# Altium schematic sheet UD3B.SchDoc
size C; PageSetup: Record=PageOptions|CenterHorizontal=True|CenterVertical=True|PrintScale=0.54|XCorrection=1.00|YCorrection=1.00|PrintKind=0|BorderSize=5000000|LeftOffset=0|BottomOffset=0|Orientation=2|PaperLength=1000|PaperWidth=1000|Scale=100|PaperSource=7|PrintQuality=-4|MediaType=1|DitherType=10|PaperKind=Letter|PrintScaleMode=1
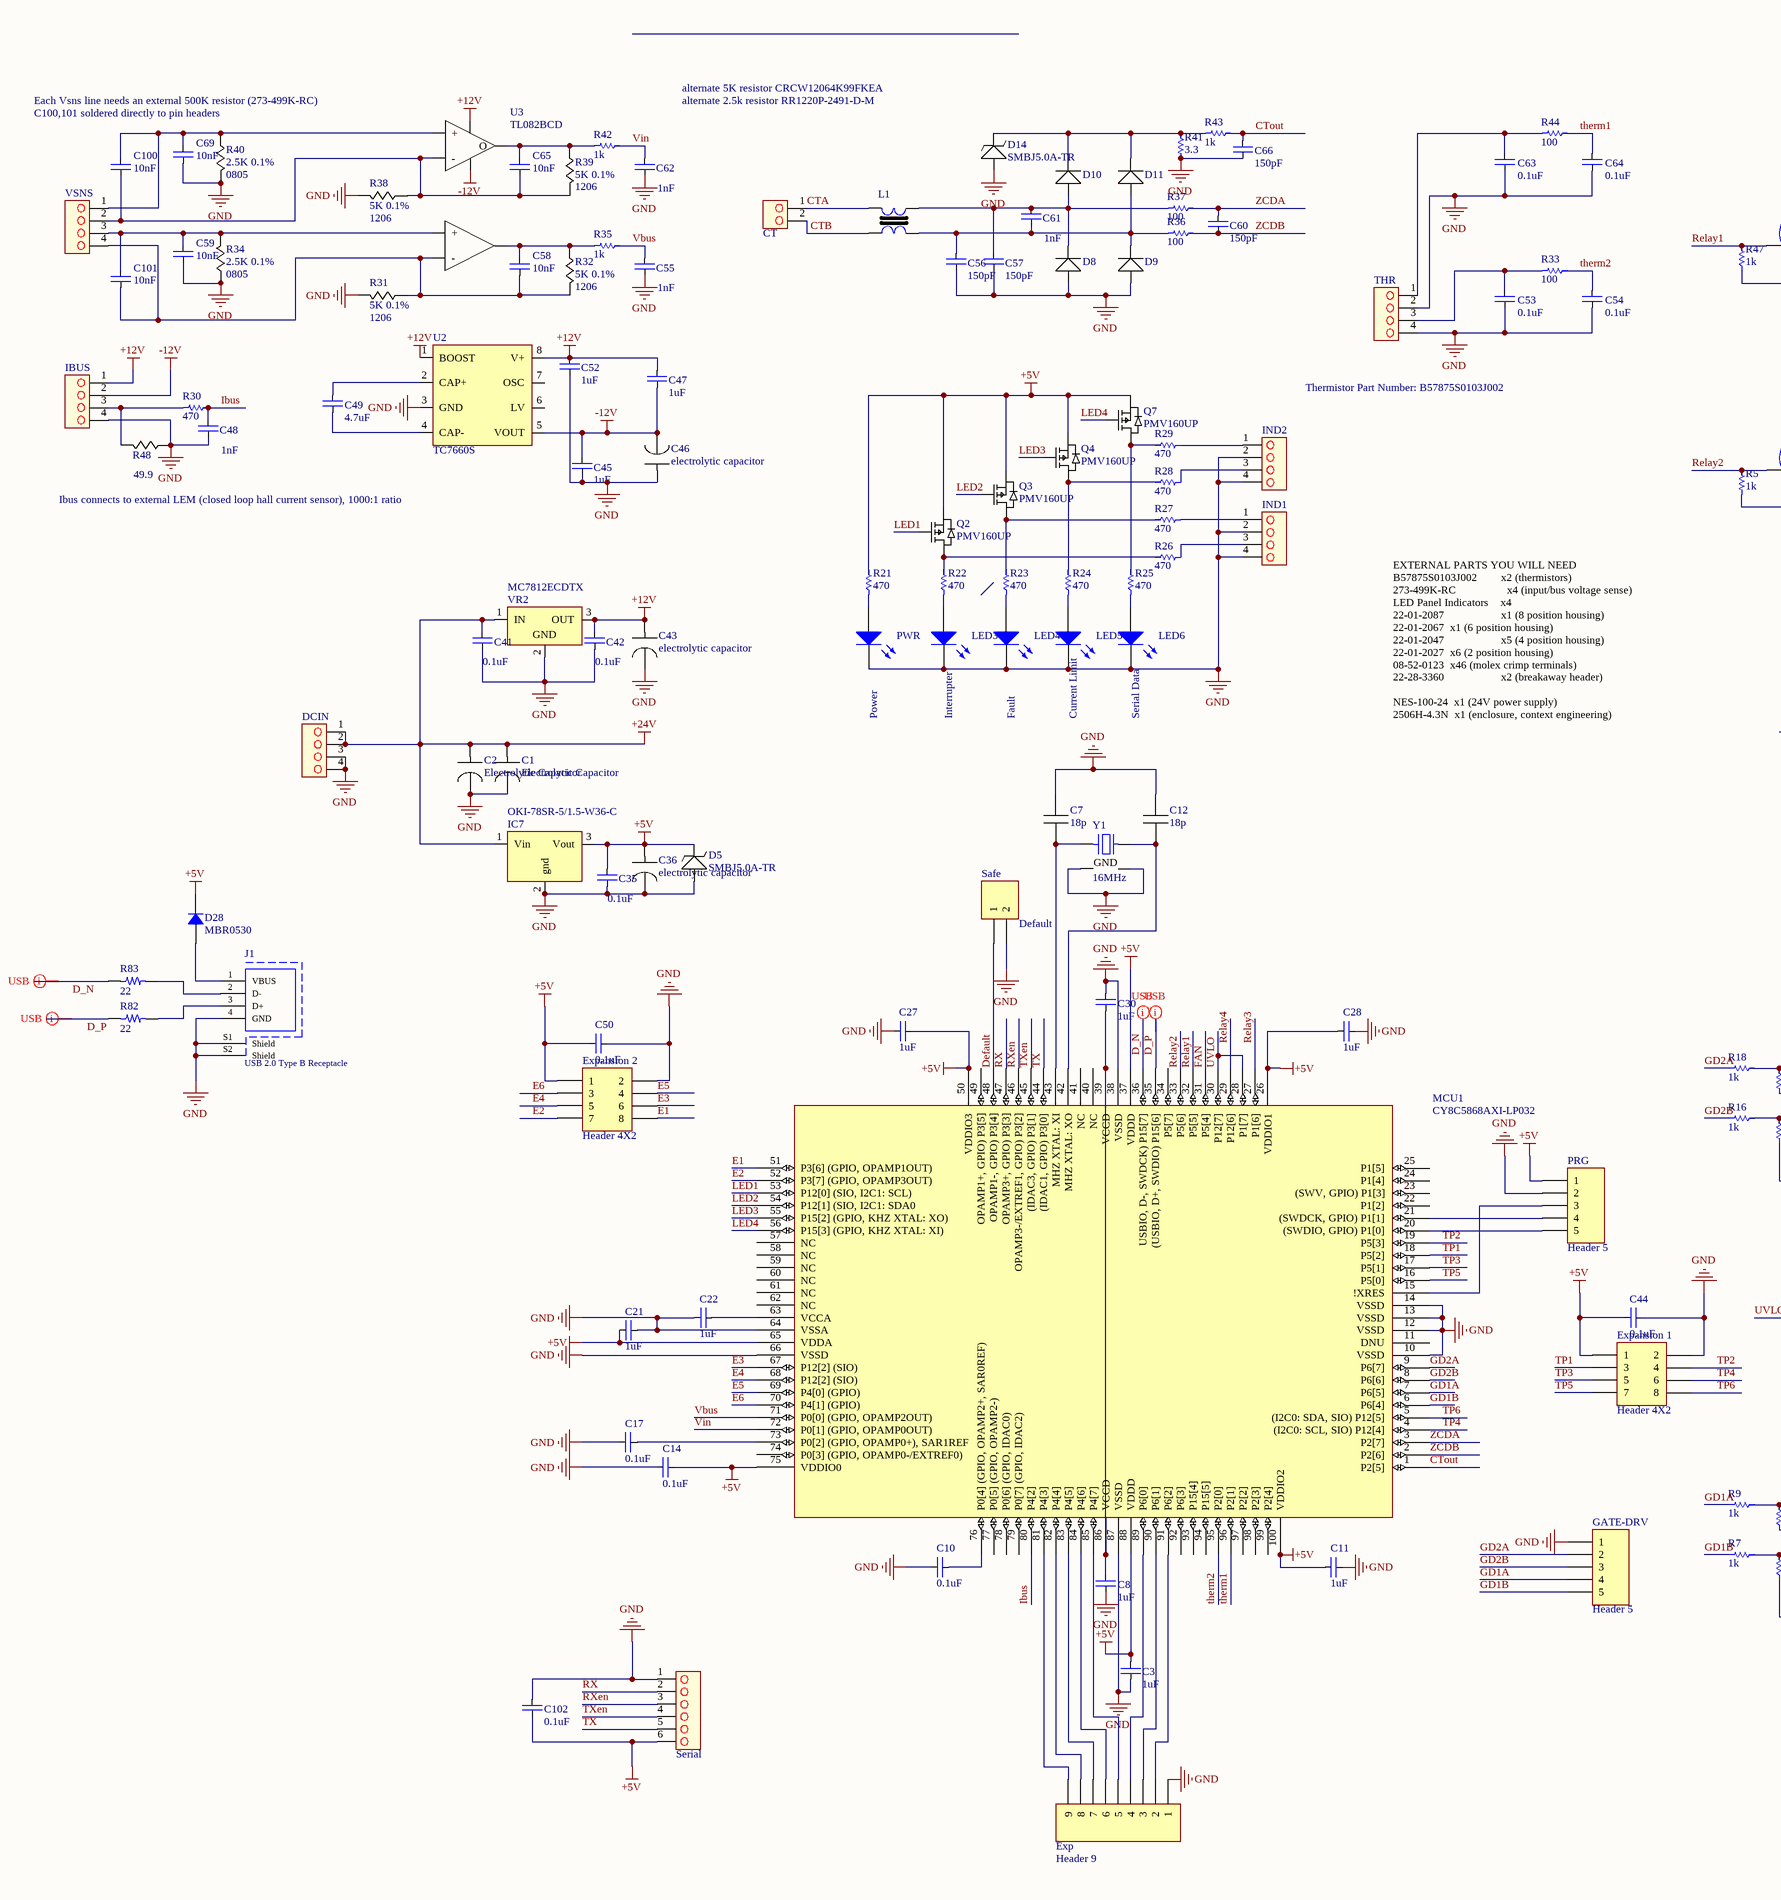
[diagram p0: UD3B.SchDoc, left]
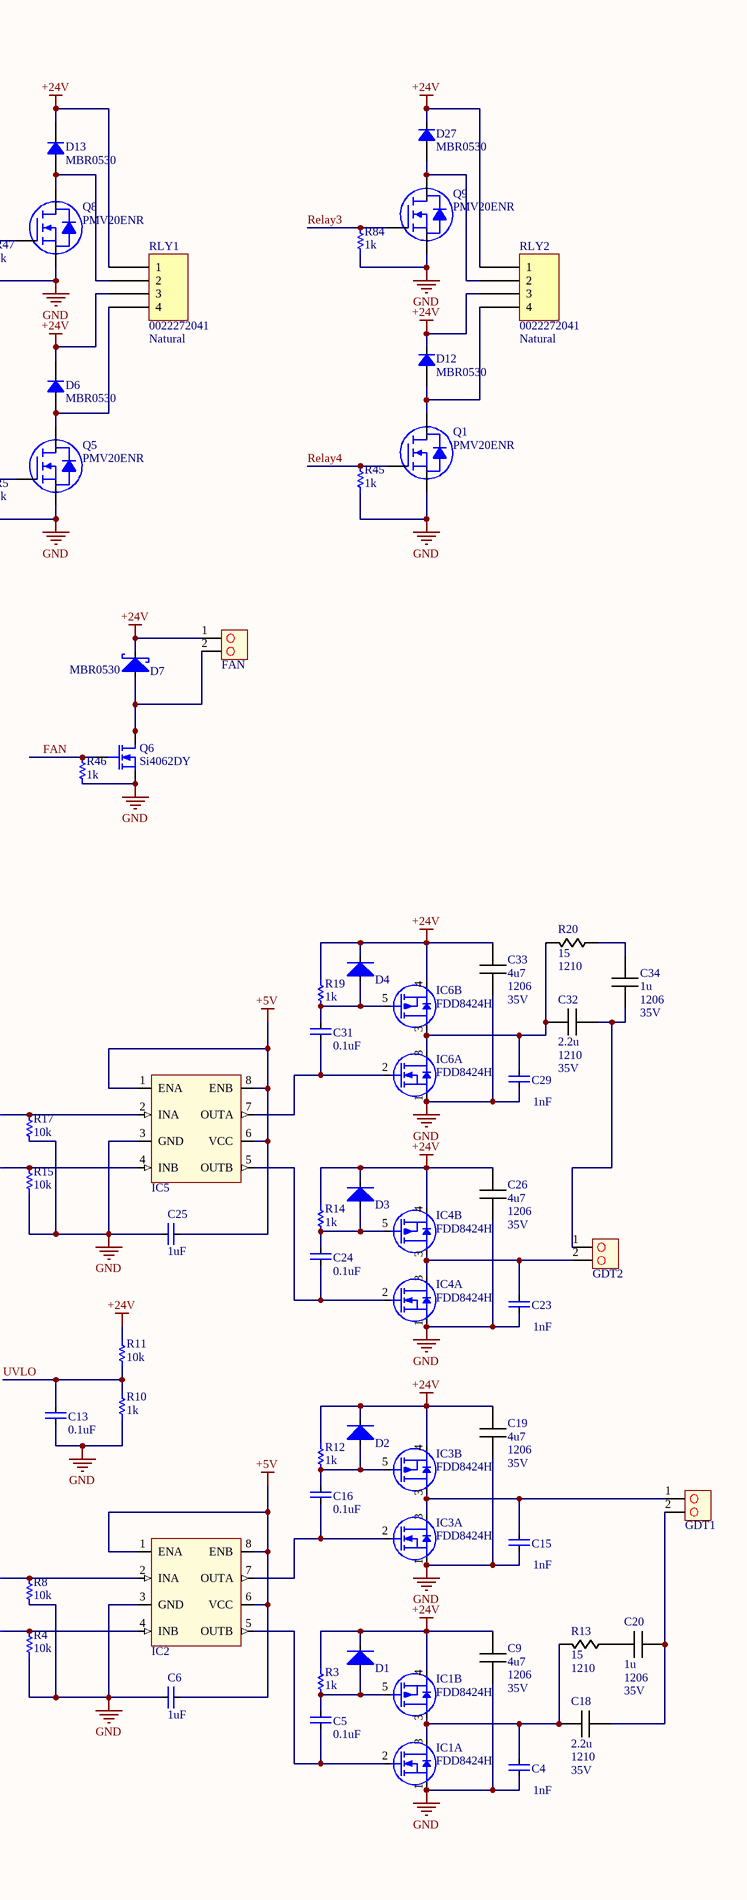
[diagram p1: UD3B.SchDoc, right]

## Parts
C1  Electrolytic Capacitor  [12.5mm lytic]
C2  Electrolytic Capacitor  [12.5mm lytic]
C3  value 1uF  [0805C]  (hidden comment: C0805C105K4RACTU)
C4  value 1nF  [0805C]  (hidden comment: C0805C102K5RACTU)
C5  value 0.1uF  [0805C]  (hidden comment: C0805C104K5RACTU)
C6  value 1uF  [0805C]  (hidden comment: C0805C105K4RACTU)
C7  Capacitance: 18p  [0805C]  (hidden comment: VJ0805A180GXACW1BC)
C8  value 1uF  [0805C]  (hidden comment: C0805C105K4RACTU)
C9  Capacitance: 4u7  package: 1206  voltage: 35V  [1206C]  (hidden comment: GRM31CF51H475ZA01K)
C10  value 0.1uF  [0805C]  (hidden comment: C0805C104K5RACTU)
C11  value 1uF  [0805C]  (hidden comment: C0805C105K4RACTU)
C12  Capacitance: 18p  [0805C]  (hidden comment: VJ0805A180GXACW1BC)
C13  value 0.1uF  [0805C]  (hidden comment: C0805C104K5RACTU)
C14  value 0.1uF  [0805C]  (hidden comment: C0805C104K5RACTU)
C15  value 1nF  [0805C]  (hidden comment: C0805C102K5RACTU)
C16  value 0.1uF  [0805C]  (hidden comment: C0805C104K5RACTU)
C17  value 0.1uF  [0805C]  (hidden comment: C0805C104K5RACTU)
C18  Capacitance: 2.2u  package: 1210  voltage: 35V  [1210C]  (hidden comment: C3225X7R1H225K)
C19  Capacitance: 4u7  package: 1206  voltage: 35V  [1206C]  (hidden comment: GRM31CF51H475ZA01K)
C20  Capacitance: 1u  package: 1206  voltage: 35V  [1206C]  (hidden comment: CC1206ZRY5V9BB105)
C21  value 1uF  [0805C]  (hidden comment: C0805C105K4RACTU)
C22  value 1uF  [0805C]  (hidden comment: C0805C105K4RACTU)
C23  value 1nF  [0805C]  (hidden comment: C0805C102K5RACTU)
C24  value 0.1uF  [0805C]  (hidden comment: C0805C104K5RACTU)
C25  value 1uF  [0805C]  (hidden comment: C0805C105K4RACTU)
C26  Capacitance: 4u7  package: 1206  voltage: 35V  [1206C]  (hidden comment: GRM31CF51H475ZA01K)
C27  value 1uF  [0805C]  (hidden comment: C0805C105K4RACTU)
C28  value 1uF  [0805C]  (hidden comment: C0805C105K4RACTU)
C29  value 1nF  [0805C]  (hidden comment: C0805C102K5RACTU)
C30  value 1uF  [0805C]  (hidden comment: C0805C105K4RACTU)
C31  value 0.1uF  [0805C]  (hidden comment: C0805C104K5RACTU)
C32  Capacitance: 2.2u  package: 1210  voltage: 35V  [1210C]  (hidden comment: C3225X7R1H225K)
C33  Capacitance: 4u7  package: 1206  voltage: 35V  [1206C]  (hidden comment: GRM31CF51H475ZA01K)
C34  Capacitance: 1u  package: 1206  voltage: 35V  [1206C]  (hidden comment: CC1206ZRY5V9BB105)
C35  value 0.1uF  [0805C]  (hidden comment: C0805C104K5RACTU)
C36  electrolytic capacitor  [6.3MM LYTIC]
C41  value 0.1uF  [0805C]  (hidden comment: C0805C104K5RACTU)
C42  value 0.1uF  [0805C]  (hidden comment: C0805C104K5RACTU)
C43  electrolytic capacitor  [6.3MM LYTIC]
C44  value 0.1uF  [0805C]  (hidden comment: C0805C104K5RACTU)
C45  value 1uF  [0805C]  (hidden comment: C0805C105K4RACTU)
C46  electrolytic capacitor  [6.3MM LYTIC]
C47  value 1uF  [0805C]  (hidden comment: C0805C105K4RACTU)
C48  value 1nF  [0805C]  (hidden comment: C0805C102K5RACTU)
C49  value 4.7uF  [1206C]  (hidden comment: GRM31CF51H475ZA01L)
C50  value 0.1uF  [0805C]  (hidden comment: C0805C104K5RACTU)
C52  value 1uF  [0805C]  (hidden comment: C0805C105K4RACTU)
C53  value 0.1uF  [0805C]  (hidden comment: C0805C105K4RACTU)
C54  value 0.1uF  [0805C]  (hidden comment: C0805C105K4RACTU)
C55  value 1nF  [0805C]  (hidden comment: C0805C102K5RACTU)
C56  value 150pF  [0805C]  (hidden comment: C0805C151J5GACTU)
C57  value 150pF  [0805C]  (hidden comment: C0805C151J5GACTU)
C58  value 10nF  [0805C]  (hidden comment: C0805C103K1RACTU)
C59  value 10nF  [0805C]  (hidden comment: C0805C103K1RACTU)
C60  value 150pF  [0805C]  (hidden comment: C0805C151J5GACTU)
C61  value 1nF  [0805C]  (hidden comment: C0805C102K5RACTU)
C62  value 1nF  [0805C]  (hidden comment: C0805C102K5RACTU)
C63  value 0.1uF  [0805C]  (hidden comment: C0805C105K4RACTU)
C64  value 0.1uF  [0805C]  (hidden comment: C0805C105K4RACTU)
C65  value 10nF  [0805C]  (hidden comment: C0805C103K1RACTU)
C66  value 150pF  [0805C]  (hidden comment: C0805C151J5GACTU)
C69  value 10nF  [0805C]  (hidden comment: C0805C103K1RACTU)
C100  value 10nF  [0805C]  (hidden comment: C0805C103K1RACTU)
C101  value 10nF  [0805C]  (hidden comment: C0805C103K1RACTU)
C102  value 0.1uF  [0805C]  (hidden comment: C0805C104K5RACTU)
CT  22-28-0020  [22-28-0020]  (value not drawn)
D1  MCL4148-TR  [MicroMELF]  (value not drawn)
D2  MCL4148-TR  [MicroMELF]  (value not drawn)
D3  MCL4148-TR  [MicroMELF]  (value not drawn)
D4  MCL4148-TR  [MicroMELF]  (value not drawn)
D5  SMBJ5.0A-TR  [SMB]
D6  MBR0530  [SOD123F]
D7  MBR0530  [SOD-123 Diode]
D8  ES2A  [DIOM4326X23N]  (value not drawn)
D9  ES2A  [DIOM4326X23N]  (value not drawn)
D10  ES2A  [DIOM4326X23N]  (value not drawn)
D11  ES2A  [DIOM4326X23N]  (value not drawn)
D12  MBR0530  [SOD123F]
D13  MBR0530  [SOD123F]
D14  SMBJ5.0A-TR  [SMB]
D27  MBR0530  [SOD123F]
D28  MBR0530  [SOD123F]
DCIN  22-28-0040  [22-28-0040]  (value not drawn)
Exp  Header 9  [HDR1X9]
Expansion_1  Header 4X2  [HDR2X4]
Expansion_2  Header 4X2  [HDR2X4]
FAN  22-28-0020  [22-28-0020]  (value not drawn)
GATE-DRV  Header 5  [HDR1X5]
GDT1  22-28-0020  [22-28-0020]  (value not drawn)
GDT2  22-28-0020  [22-28-0020]  (value not drawn)
IBUS  22-28-0040  [22-28-0040]  (value not drawn)
IC1  FDD8424H  [TO-252]  (parts A,B of 2)
IC2  UCC27423D  [SOIC-8]  (value not drawn)
IC3  FDD8424H  [TO-252]  (parts A,B of 2)
IC4  FDD8424H  [TO-252]  (parts A,B of 2)
IC5  UCC27423D  [SOIC-8]  (value not drawn)
IC6  FDD8424H  [TO-252]  (parts A,B of 2)
IC7  OKI-78SR-5/1.5-W36-C  [OKI-78SR vertical]
IND1  22-28-0040  [22-28-0040]  (value not drawn)
IND2  22-28-0040  [22-28-0040]  (value not drawn)
J1  USB 2.0 Type B Receptacle  [61400413321]
L1  DLW5BTN501SQ2L  [DLW5BS]  (value not drawn)
LED3  598-8170-107F  [0805LED]  (value not drawn)
LED4  LS R976-NR-1  [0805LED]  (value not drawn)
LED5  598-8170-107F  [0805LED]  (value not drawn)
LED6  LTST-C171TBKT  [0805LED]  (value not drawn)
MCU1  CY8C5868AXI-LP032  [TQFP100]
PRG  Header 5  [HDR1X5]
PWR  LS R976-NR-1  [0805LED]  (value not drawn)
Q1  PMV20ENR  [NXP SOT-23-3 TO-236AB]
Q2  PMV160UP  [SOT95P245X110-3N]
Q3  PMV160UP  [SOT95P245X110-3N]
Q4  PMV160UP  [SOT95P245X110-3N]
Q5  PMV20ENR  [NXP SOT-23-3 TO-236AB]
Q6  Si4062DY  [SO-8]
Q7  PMV160UP  [SOT95P245X110-3N]
Q8  PMV20ENR  [NXP SOT-23-3 TO-236AB]
Q9  PMV20ENR  [NXP SOT-23-3 TO-236AB]
R3  value 1k  [0805R]  (hidden comment: CRCW08051K00FKEA)
R4  value 10k  [0805R]  (hidden comment: CRCW080510K0FKEA)
R5  value 1k  [0805R]  (hidden comment: CRCW08051K00FKEA)
R7  value 1k  [0805R]  (hidden comment: CRCW08051K00FKEA)
R8  value 10k  [0805R]  (hidden comment: CRCW080510K0FKEA)
R9  value 1k  [0805R]  (hidden comment: CRCW08051K00FKEA)
R10  value 1k  [0805R]  (hidden comment: CRCW08051K00FKEA)
R11  value 10k  [0805R]  (hidden comment: CRCW080510K0FKEA)
R12  value 1k  [0805R]  (hidden comment: CRCW08051K00FKEA)
R13  Resistance: 15  Package: 1210  [1210R]  (hidden comment: CRCW121015R0JNEAHP)
R14  value 1k  [0805R]  (hidden comment: CRCW08051K00FKEA)
R15  value 10k  [0805R]  (hidden comment: CRCW080510K0FKEA)
R16  value 1k  [0805R]  (hidden comment: CRCW08051K00FKEA)
R17  value 10k  [0805R]  (hidden comment: CRCW080510K0FKEA)
R18  value 1k  [0805R]  (hidden comment: CRCW08051K00FKEA)
R19  value 1k  [0805R]  (hidden comment: CRCW08051K00FKEA)
R20  Resistance: 15  Package: 1210  [1210R]  (hidden comment: CRCW121015R0JNEAHP)
R21  value 470  [0805R]  (hidden comment: CRCW0805470RFKEA)
R22  value 470  [0805R]  (hidden comment: CRCW0805470RFKEA)
R23  value 470  [0805R]  (hidden comment: CRCW0805470RFKEA)
R24  value 470  [0805R]  (hidden comment: CRCW0805470RFKEA)
R25  value 470  [0805R]  (hidden comment: CRCW0805470RFKEA)
R26  value 470  [0805R]  (hidden comment: CRCW0805470RFKEA)
R27  value 470  [0805R]  (hidden comment: CRCW0805470RFKEA)
R28  value 470  [0805R]  (hidden comment: CRCW0805470RFKEA)
R29  value 470  [0805R]  (hidden comment: CRCW0805470RFKEA)
R30  value 470  [0805R]  (hidden comment: CRCW0805470RFKEA)
R31  Resistance: 5K 0.1%  Package: 1206  [1206R]  (hidden comment: RN732BTTD5001B25)
R32  Resistance: 5K 0.1%  Package: 1206  [1206R]  (hidden comment: RN732BTTD5001B25)
R33  value 100  [0805R]  (hidden comment: CRCW0805100RFKEA)
R34  Resistance: 2.5K 0.1%  Package: 0805  [0805R]  (hidden comment: RN732ATTD2501B25)
R35  value 1k  [0805R]  (hidden comment: CRCW08051K00FKEA)
R36  value 100  [0805R]  (hidden comment: CRCW0805100RFKEA)
R37  value 100  [0805R]  (hidden comment: CRCW0805100RFKEA)
R38  Resistance: 5K 0.1%  Package: 1206  [1206R]  (hidden comment: RN732BTTD5001B25)
R39  Resistance: 5K 0.1%  Package: 1206  [1206R]  (hidden comment: RN732BTTD5001B25)
R40  Resistance: 2.5K 0.1%  Package: 0805  [0805R]  (hidden comment: RN732ATTD2501B25)
R41  value 3.3  [MOS2CT52R510J]  (hidden comment: 261-3.3-RC)
R42  value 1k  [0805R]  (hidden comment: CRCW08051K00FKEA)
R43  value 1k  [0805R]  (hidden comment: CRCW08051K00FKEA)
R44  value 100  [0805R]  (hidden comment: CRCW0805100RFKEA)
R45  value 1k  [0805R]  (hidden comment: CRCW08051K00FKEA)
R46  value 1k  [0805R]  (hidden comment: CRCW08051K00FKEA)
R47  value 1k  [0805R]  (hidden comment: CRCW08051K00FKEA)
R48  Resistance: 49.9  [1210R]  (hidden comment: CRCW121049R9FKEA)
R82  22  [RES 0603/1608]
R83  22  [RES 0603/1608]
R84  value 1k  [0805R]  (hidden comment: CRCW08051K00FKEA)
RLY1  0022272041  Colour: Natural  [MOLEX KK 0022272041]
RLY2  0022272041  Colour: Natural  [MOLEX KK 0022272041]
Safe  Default  [HDR1X2]
Serial  22-28-0060  [22-28-0060]  (value not drawn)
THR  22-28-0040  [22-28-0040]  (value not drawn)
U2  TC7660S  [SO-8]
U3  TL082BCD  [SO-8]
VR2  MC7812ECDTX  [DPAK alt]
VSNS  22-28-0040  [22-28-0040]  (value not drawn)
Y1  16MHz  [ABRACON ABM8G]

## Nets
+5V: C3.1 C6.1 C11.1 C14.2 C21.2 C25.1 C27.1 C28.2 C35.2 C36.1 C44.2 C50.2 C102.1 D5.2(K) D28.2 Expansion_1.1 Expansion_2.1 IC2.1(ENA) IC2.6(VCC) IC2.8(ENB) IC5.1(ENA) IC5.6(VCC) IC5.8(ENB) IC7.3(Vout) MCU1.26(VDDIO1) MCU1.37(VDDD) MCU1.50(VDDIO3) MCU1.65(VDDA) MCU1.75(VDDIO0) MCU1.88(VDDD) MCU1.100(VDDIO2) PRG.1 Q2.2(S) Q3.2(S) Q4.2(S) Q7.2(S) R21.2 Serial.6
+12V: C42.2 C43.1 C47.2 C52.2 IBUS.1 U2.1(BOOST) U2.8(V+) U3.8(Vcc) VR2.3(OUT)
+24V: C1.1 C2.1 C9.1 C19.1 C26.1 C33.1 C41.2 D1.K D2.K D3.K D4.K D6.2 D7.K D12.2 D13.2 D27.2 DCIN.1 DCIN.2 FAN.1 IC1.4(S2) IC3.4(S2) IC4.4(S2) IC6.4(S2) IC7.1(Vin) R3.2 R11.2 R12.2 R14.2 R19.2 RLY1.1 RLY1.3 RLY2.1 RLY2.3 VR2.1(IN)
-12V: C45.2 C46.2 C47.1 IBUS.2 U2.5(VOUT) U3.4(Vss)
GND: C1.2 C2.2 C3.2 C4.1 C6.2 C7.1 C8.2 C9.2 C10.1 C11.2 C12.1 C13.1 C14.1 C15.1 C17.1 C19.2 C21.1 C22.2 C23.1 C25.2 C26.2 C27.2 C28.1 C29.1 C30.2 C33.2 C35.1 C36.2 C41.1 C42.1 C43.2 C44.1 C45.1 C46.1 C48.1 C50.1 C52.1 C53.1 C54.1 C55.1 C56.1 C57.1 C59.1 C62.1 C63.1 C64.1 C66.1 C69.1 C102.2 D5.1(A) D8.1(A) D9.1(A) D14.1(A) DCIN.3 DCIN.4 Exp.1 Expansion_1.2 Expansion_2.2 GATE-DRV.1 IBUS.4 IC1.1(S1) IC2.3(GND) IC3.1(S1) IC4.1(S1) IC5.3(GND) IC6.1(S1) IC7.2(gnd) IND1.2 IND1.4 IND2.2 IND2.4 J1.4(GND) J1.S1(Shield) J1.S2(Shield) LED3.2(K) LED4.2(K) LED5.2(K) LED6.2(K) MCU1.10(VSSD) MCU1.12(VSSD) MCU1.13(VSSD) MCU1.14(VSSD) MCU1.38(VSSD) MCU1.64(VSSA) MCU1.66(VSSD) MCU1.87(VSSD) PRG.2 PWR.2(K) Q1.3(S) Q5.3(S) Q6.1(S) Q6.2(S) Q6.3(S) Q8.3(S) Q9.3(S) R4.1 R5.1 R8.1 R10.1 R15.1 R17.1 R31.1 R34.2 R38.1 R40.1 R41.1 R45.1 R46.1 R47.1 R48.2 R84.1 Safe.2 Serial.1 THR.2 THR.4 U2.3(GND) VR2.2(GND) Y1.2(GND) Y1.4(GND)
CTA: CT.1 L1.1
CTB: CT.2 L1.4
CTout: C66.2 MCU1.1(P2[5]) R43.2
D_N: MCU1.36(USBIO,_D-,_SWDCK)_P15[7]) R83.2
D_P: MCU1.35((USBIO,_D+,_SWDIO)_P15[6]) R82.2
Default: MCU1.48(OPAMP1-,_GPIO)_P3[4]) Safe.1
E1: Expansion_2.8 MCU1.51(P3[6]_(GPIO,_OPAMP1OUT))
E2: Expansion_2.7 MCU1.52(P3[7]_(GPIO,_OPAMP3OUT))
E3: Expansion_2.6 MCU1.67(P12[2]_(SIO))
E4: Expansion_2.5 MCU1.68(P12[2]_(SIO))
E5: Expansion_2.4 MCU1.69(P4[0]_(GPIO))
E6: Expansion_2.3 MCU1.70(P4[1]_(GPIO))
FAN: MCU1.31(P5[4]) Q6.4(G) R46.2
GD1A: GATE-DRV.4 MCU1.7(P6[5]) R9.1
GD1B: GATE-DRV.5 MCU1.6(P6[4]) R7.1
GD2A: GATE-DRV.2 MCU1.9(P6[7]) R18.1
GD2B: GATE-DRV.3 MCU1.8(P6[6]) R16.1
Ibus: C48.2 MCU1.80(P4[2]) R30.2
LED1: MCU1.53(P12[0]_(SIO,_I2C1:_SCL)) Q2.1(G)
LED2: MCU1.54(P12[1]_(SIO,_I2C1:_SDA0) Q3.1(G)
LED3: MCU1.55(P15[2]_(GPIO,_KHZ_XTAL:_XO)) Q4.1(G)
LED4: MCU1.56(P15[3]_(GPIO,_KHZ_XTAL:_XI)) Q7.1(G)
Relay1: MCU1.32(P5[5]) Q8.1(G) R47.2
Relay2: MCU1.33(P5[6]) Q5.1(G) R5.2
Relay3: MCU1.27(P1[6]) Q9.1(G) R84.2
Relay4: MCU1.29(P12[6]) Q1.1(G) R45.2
RX: MCU1.47(OPAMP3+,_GPIO)_P3[3]) Serial.2
RXen: MCU1.46(OPAMP3-/EXTREF1,_GPIO)_P3[2]) Serial.3
therm1: C64.2 MCU1.96(P2[1]) R44.2
therm2: C54.2 MCU1.95(P2[0]) R33.2
TP1: Expansion_1.3 MCU1.18(P5[2])
TP2: Expansion_1.4 MCU1.19(P5[3])
TP3: Expansion_1.5 MCU1.17(P5[1])
TP4: Expansion_1.6 MCU1.4((I2C0:_SCL,_SIO)_P12[4])
TP5: Expansion_1.7 MCU1.16(P5[0])
TP6: Expansion_1.8 MCU1.5((I2C0:_SDA,_SIO)_P12[5])
TX: MCU1.44((IDAC1,_GPIO)_P3[0]) Serial.5
TXen: MCU1.45((IDAC3,_GPIO)_P3[1]) Serial.4
UVLO: C13.2 MCU1.28(P1[7]) MCU1.30(P12[7]) R10.2 R11.1
Vbus: C55.2 MCU1.71(P0[0]_(GPIO,_OPAMP2OUT)) R35.2
Vin: C62.2 MCU1.72(P0[1]_(GPIO,_OPAMP0OUT)) R42.2
ZCDA: C60.2 MCU1.3(P2[7]) R37.2
ZCDB: C60.1 MCU1.2(P2[6]) R36.2
NetC4_2: C4.2 C18.1 IC1.3(D1/D2) R13.1
NetC5_1: C5.1 IC1.2(G1) IC2.5(OUTB)
NetC5_2: C5.2 D1.A IC1.5(G2) R3.1
NetC7_2: C7.2 MCU1.43(MHZ_XTAL:_XI) Y1.1
NetC8_1: C8.1 C30.1 MCU1.39(VCCD) MCU1.86(VCCD)
NetC10_2: C10.2 MCU1.76(P0[4]_(GPIO,_OPAMP2+,_SAR0REF))
NetC12_2: C12.2 MCU1.42(MHZ_XTAL:_XO) Y1.3
NetC15_2: C15.2 GDT1.1 IC3.3(D1/D2)
NetC16_1: C16.1 IC2.7(OUTA) IC3.2(G1)
NetC16_2: C16.2 D2.A IC3.5(G2) R12.1
NetC17_2: C17.2 MCU1.73(P0[2]_(GPIO,_OPAMP0+),_SAR1REF)
NetC18_2: C18.2 C20.2 GDT1.2
NetC20_1: C20.1 R13.2
NetC22_1: C22.1 MCU1.63(VCCA)
NetC23_2: C23.2 GDT2.2 IC4.3(D1/D2)
NetC24_1: C24.1 IC4.2(G1) IC5.5(OUTB)
NetC24_2: C24.2 D3.A IC4.5(G2) R14.1
NetC29_2: C29.2 C32.1 IC6.3(D1/D2) R20.1
NetC31_1: C31.1 IC5.7(OUTA) IC6.2(G1)
NetC31_2: C31.2 D4.A IC6.5(G2) R19.1
NetC32_2: C32.2 C34.1 GDT2.1
NetC34_2: C34.2 R20.2
NetC49_1: C49.1 U2.4(CAP-)
NetC49_2: C49.2 U2.2(CAP+)
NetC53_2: C53.2 R33.1 THR.3
NetC56_2: C56.2 C61.1 D9.2(K) D11.1(A) L1.3 R36.1
NetC57_2: C57.2 C61.2 D8.2(K) D10.1(A) L1.2 R37.1
NetC58_1: C58.1 C101.1 R31.2 R32.1 U3.6(-) VSNS.4
NetC58_2: C58.2 R32.2 R35.1 U3.7(O)
NetC59_2: C59.2 C101.2 R34.1 U3.5(+) VSNS.3
NetC63_2: C63.2 R44.1 THR.1
NetC65_1: C65.1 C100.1 R38.2 R39.1 U3.2(-) VSNS.2
NetC65_2: C65.2 R39.2 R42.1 U3.1(O)
NetC69_2: C69.2 C100.2 R40.2 U3.3(+) VSNS.1
NetD6_1: D6.1 Q5.2(D) RLY1.4
NetD7_A: D7.A FAN.2 Q6.5(D) Q6.6(D) Q6.7(D) Q6.8(D)
NetD10_2: D10.2(K) D11.2(K) D14.2(K) R41.2 R43.1
NetD12_1: D12.1 Q1.2(D) RLY2.4
NetD13_1: D13.1 Q8.2(D) RLY1.2
NetD27_1: D27.1 Q9.2(D) RLY2.2
NetD28_1: D28.1 J1.1(VBUS)
NetExp_2: Exp.2 MCU1.91(P6[2])
NetExp_3: Exp.3 MCU1.90(P6[1])
NetExp_4: Exp.4 MCU1.89(P6[0])
NetExp_5: Exp.5 MCU1.85(P4[7])
NetExp_6: Exp.6 MCU1.84(P4[6])
NetExp_7: Exp.7 MCU1.83(P4[5])
NetExp_8: Exp.8 MCU1.82(P4[4])
NetExp_9: Exp.9 MCU1.81(P4[3])
NetIBUS_3: IBUS.3 R30.1 R48.1
NetIC2_2: IC2.2(INA) R8.2 R9.2
NetIC2_4: IC2.4(INB) R4.2 R7.2
NetIC5_2: IC5.2(INA) R17.2 R18.2
NetIC5_4: IC5.4(INB) R15.2 R16.2
NetIND1_1: IND1.1 R27.1
NetIND1_3: IND1.3 R26.1
NetIND2_1: IND2.1 R29.1
NetIND2_3: IND2.3 R28.1
NetJ1_2: J1.2(D-) R83.1
NetJ1_3: J1.3(D+) R82.1
NetLED3_1: LED3.1(A) R22.1
NetLED4_1: LED4.1(A) R23.1
NetLED5_1: LED5.1(A) R24.1
NetLED6_1: LED6.1(A) R25.1
NetMCU1_15: MCU1.15(!XRES) PRG.3
NetMCU1_20: MCU1.20((SWDIO,_GPIO)_P1[0]) PRG.5
NetMCU1_21: MCU1.21((SWDCK,_GPIO)_P1[1]) PRG.4
NetPWR_1: PWR.1(A) R21.1
NetQ2_3: Q2.3(D) R22.2 R26.2
NetQ3_3: Q3.3(D) R23.2 R27.2
NetQ4_3: Q4.3(D) R24.2 R28.2
NetQ7_3: Q7.3(D) R25.2 R29.2

Not connected (* = marked no-connect by the designer): MCU1 11(DNU) 22(P1[2]) 23((SWV,_GPIO)_P1[3]) 24(P1[4]) 25(P1[5]) 34(P5[7]) 40(NC) 41(NC) 49(OPAMP1+,_GPIO)_P3[5]) 57(NC) 58(NC) 59(NC) 60(NC) 61(NC) 62(NC) 74(P0[3]_(GPIO,_OPAMP0-/EXTREF0)) 77(P0[5]_(GPIO,_OPAMP2-)) 78(P0[6]_(GPIO,_IDAC0)) 79(P0[7]_(GPIO,_IDAC2)) 92(P6[3]) 93(P15[4]) 94(P15[5]) 97(P2[2]) 98(P2[3]) 99(P2[4]); U2 6(LV) 7(OSC)

## Layout directives
differential pair: D_N, D_P

## Notes on the sheet
- Each Vsns line needs an external 500K resistor (273-499K-RC)
- C100,101 soldered directly to pin headers
- alternate 5K resistor CRCW12064K99FKEA
- alternate 2.5k resistor RR1220P-2491-D-M
- Thermistor Part Number: B57875S0103J002
- Ibus connects to external LEM (closed loop hall current sensor), 1000:1 ratio
- (near PWR) Power
- (near LED3) Interrupter
- Fault
- (near LED5) Current Limit
- (near LED6) Serial Data
- EXTERNAL PARTS YOU WILL NEED
  B57875S0103J002       	x2 (thermistors)
  273-499K-RC                	x4 (input/bus voltage sense)
  LED Panel Indicators   	x4
  22-01-2087                  	x1 (8 position housing)
  22-01-2067		x1 (6 position housing)
  22-01-2047                  	x5 (4 position housing)
  22-01-2027		x6 (2 position housing)
  08-52-0123		x46 (molex crimp terminals)
  22-28-3360                  	x2 (breakaway header)
  NES-100-24		x1 (24V power supply)
  2506H-4.3N		x1 (enclosure, context engineering)

## Library data of the parts
C3 C6 C8 C11 C21 C22 C25 C27 C28 C30 C45 C47 C52-C54 C63 C64 = C0805C105K4RACTU: Capacitor, 1uF, MLCC, 16V, X7R, 10%, SMD
C4 C15 C23 C29 C48 C55 C61 C62 = C0805C102K5RACTU: Capacitor, 1nF, MLCC, 50V, X7R, 10%, SMD
C5 C10 C13 C14 C16 C17 C24 C31 C35 C41 C42 C44 C50 C102 = C0805C104K5RACTU: Capacitor, 0.1uF, MLCC, 50V, X7R, 10%, SMD
C7 C9 C12 C18-C20 C26 C32-C34 = Capacitor: tolerance: *; type: *; material: *
C49 = GRM31CF51H475ZA01L: Capacitor, 4.7uF, MLCC, 50V, Y5V, +80-20%
C56 C57 C60 C66 = C0805C151J5GACTU: Capacitor, 150pF, MLCC, 50V, COG, 5%, SMD
C58 C59 C65 C69 C100 C101 = C0805C103K1RACTU: Capacitor, 10nF, MLCC, 50V, X7R, 10%, SMD
CT FAN GDT1 GDT2 = 22-28-0020: Pin Header, 2 Position, Locking, .1 Centers
D1-D4 = MCL4148-TR: Diode, 100V, 350mA, Small Switching, SMD
D5 D14 = SMBJ170A
D6 D12 D13 D27 D28 = MBR0530: DIODE SCHOTTKY 30V 500MA SOD123; Manufacturer: Fairchild Semiconductor; Type: Surface Mount; Current Reverse Leakage @ Vr: 130uA @ 30V; Voltage Forward (Vf): 430mV @ 500mA; Part Number: MBR0530; PartId: 7121; Supplier 1: Digi-Key; Supplier Part Number 1: MBR0530TR-ND; ComponentLink1Description: Datasheet; ComponentLink1URL: http://www.fairchildsemi.com/datasheets/MB/MBR0530.pdf; ComponentLink2Description: Digi-Key Listing; ComponentLink2URL: http://www.digikey.ca/product-detail/en/MBR0530/MBR0530TR-ND/1048783; Junction Operating Temperature: -65C ~ 125C; Price: 0,0818; Device Package: SOD-123; Reverse Recovery Time (trr): -; Voltage DC Reverse (Vr): 30V; Current Rectified: 500mA
D7 = MBR0530: Diode, Schottky, 30V, 500mA, SMD
D8-D11 = US1J-13-F
DCIN IBUS IND1 IND2 THR VSNS = 22-28-0040: Pin Header, 4 Position, Locing, .1 Centers
Exp = Header 9: Header, 9-Pin; LatestRevisionDate: 17-Jul-2002; LatestRevisionNote: Re-released for DXP Platform.; Publisher: Altium Limited
Expansion_1 Expansion_2 = Header 4X2: Header, 4-Pin, Dual row; LatestRevisionDate: 17-Jul-2002; LatestRevisionNote: Re-released for DXP Platform.; Publisher: Altium Limited
GATE-DRV PRG = Header 5: Header, 5-Pin; LatestRevisionDate: 17-Jul-2002; LatestRevisionNote: Re-released for DXP Platform.; Publisher: Altium Limited
IC1 IC3 IC4 IC6 = FDD8424H: Mosfet, NP CH, 40V, -40V, 20A
IC2 IC5 = UCC27423D: Mosfet Driver, Dual-Inverting, SOIC-D; Manufacturer: Texas Instruments; Manf. P/N: UCC27322D
IC7 = OKI-78SR
J1 = 61400413321: USB 2.0 Type B, Receptacle, Vertical, THT; Rated Current: 1.5A; Pin Number: 4; Interface Type: Type B; Working Voltage: 30VAC; ComponentLink1Description: Manufacturer; ComponentLink1URL: http://www.we-online.de; ComponentLink2Description: Datasheet; ComponentLink2URL: https://katalog.we-online.com/em/datasheet/61400413321.pdf; Published Date: September 2019; Publisher: Wurth Elektronik; Part Number: 61400413321; Gender: Receptacle; Type: Vertical; Packaging: Tray; Operating Temperature: -40 to +105degC; Mounting Technology: THT; Application: USB 2.0
L1 = common mode choke
LED3 LED5 = HLMP-6700-G0011: GREEN LED; LuminousIntensity: 1.4mcd (Minimum).; LED_Colour: Yellow; PCB_Layout: Complies with manufacturer's recommendation.; Note: SIM model accounts for the Domed Subminiature Resistor. Extra resistance has been added to the parameter RS.; Published: 11-Dec-2002; LatestRevisionDate: 19-Mar-2004; LatestRevisionNote: Silkscreen size reduced.; DatasheetVersion: 30-Apr-2002; PackageVersion: Apr-2001; PackageReference: 2.2X2.1X2.9; Publisher: Altium Limited; PackageDescription: SM LED; 2 Gull Wing Leads; Body 2.2 x 2.1 mm, (LxW); ComponentLink1Description: Manufacturer Link; ComponentLink1URL: http://www.avagotech.com/; ComponentLink2Description: Datasheet; ComponentLink2URL: http://cp.literature.agilent.com/litweb/pdf/5988-6260EN.pdf
LED4 PWR = HLMP-6700-G0011: RED LED; LuminousIntensity: 1.4mcd (Minimum).; LED_Colour: Yellow; PCB_Layout: Complies with manufacturer's recommendation.; Note: SIM model accounts for the Domed Subminiature Resistor. Extra resistance has been added to the parameter RS.; Published: 11-Dec-2002; LatestRevisionDate: 19-Mar-2004; LatestRevisionNote: Silkscreen size reduced.; DatasheetVersion: 30-Apr-2002; PackageVersion: Apr-2001; PackageReference: 2.2X2.1X2.9; Publisher: Altium Limited; PackageDescription: SM LED; 2 Gull Wing Leads; Body 2.2 x 2.1 mm, (LxW); ComponentLink1Description: Manufacturer Link; ComponentLink1URL: http://www.avagotech.com/; ComponentLink2Description: Datasheet; ComponentLink2URL: http://cp.literature.agilent.com/litweb/pdf/5988-6260EN.pdf
LED6 = HLMP-6700-G0011: BLUE LED; LuminousIntensity: 1.4mcd (Minimum).; LED_Colour: Yellow; PCB_Layout: Complies with manufacturer's recommendation.; Note: SIM model accounts for the Domed Subminiature Resistor. Extra resistance has been added to the parameter RS.; Published: 11-Dec-2002; LatestRevisionDate: 19-Mar-2004; LatestRevisionNote: Silkscreen size reduced.; DatasheetVersion: 30-Apr-2002; PackageVersion: Apr-2001; PackageReference: 2.2X2.1X2.9; Publisher: Altium Limited; PackageDescription: SM LED; 2 Gull Wing Leads; Body 2.2 x 2.1 mm, (LxW); ComponentLink1Description: Manufacturer Link; ComponentLink1URL: http://www.avagotech.com/; ComponentLink2Description: Datasheet; ComponentLink2URL: http://cp.literature.agilent.com/litweb/pdf/5988-6260EN.pdf
MCU1 = CY8C5466AXI-064
Q1 Q5 Q8 Q9 = PMV20ENR: MOSFET N-CH 30V SOT23; Manufacturer: NXP Semiconductors; Type: MOSFET N-Channel, Metal Oxide; Rds On (Max) at Id, Vgs: 21 mOhm @ 6A, 10V; Vgs(th) (Max) at Id: 2V @ 250uA; Gate Charge (Qg): 10.8nC @ 10V; Input Capacitance (Ciss) at Vds: 435pF @ 15V; Power - Max: 510mW; Current Continuous Drain: 6A (Ta); Part Number: PMV20ENR; PartId: 8074; Supplier 1: Digi-Key; Supplier Part Number 1: 568-12587-2-ND; ComponentLink1Description: Datasheet; ComponentLink1URL: http://www.nxp.com/documents/data_sheet/PMV20EN.pdf; ComponentLink2Description: Digi-Key Listing; ComponentLink2URL: http://www.digikey.com/product-detail/en/PMV20ENR/568-12587-2-ND/5395792; Price: 0,1072; Device Package: TO-236-3, SC-59, SOT-23-3; Drain to Source Voltage (Vdss): 30V; Features: Logic Level Gate
R3 R5 R7 R9 R10 R12 R14 R16 R18 R19 R33 R35-R37 R42-R47 R84 = CRCW08051K00FKEA: Resistor, Thick Film, 1K, 1/8W, 150V, 1%, SMD
R4 R8 R11 R15 R17 = CRCW080510K0FKEA: Resistor, Thick Film, 10K, 1/8W, 150V, 1%, SMD
R13 R20 R31 R32 R34 R38-R40 R48 = Resistor: Power: *
  R48: Package: *
R21-R30 = CRCW0805470RFKEA: Resistor, Thick Film, 470, 1/8W, 150V, 1%, SMD
R41 = CMF60100R00JKEA: Resistor, 100 Ohm, 1/2W, 500V, 5%
R82 R83 = ERJ-3EKF22R0V: RES SMD 22 OHM 1% 1/10W 0603; Manufacturer: Panasonic Electronic Components; TemperatureRange: -55C ~ 155C; TemperatureCoefficient: 100ppm/C; PowerRating: 0.1W, 1/10W; Value: 22; Part Number: ERJ-3EKF22R0V; PartId: 984; Supplier 1: Digi-Key; Supplier Part Number 1: P22.0HTR-ND; ComponentLink1Description: Datasheet; ComponentLink1URL: http://industrial.panasonic.com/www-cgi/jvcr13pz.cgi?E+PZ+3+AOA0002+ERJ3EKF22R0V+7+WW; ComponentLink2Description: Digi-Key listing; ComponentLink2URL: http://digikey.com/product-detail/en/ERJ-3EKF22R0V/P22.0HTR-ND/1746340; Tolerance: 1%; Price: 0,0038; Type: Thick Film; Device Package: 0603 (1608 Metric)
RLY1 RLY2 = 0022272041: CONN HEADER 4POS .100 VERT TIN; Manufacturer: Molex, LLC; Pitch: 0.100" (2.54mm); Number Of Positions: 4; Part Number: 0022272041; PartId: 9721; Supplier 1: Digi-Key; Supplier Part Number 1: WM4113-ND; ComponentLink1Description: Datasheet; ComponentLink1URL: http://www.molex.com/pdm_docs/sd/022272041_sd.pdf; ComponentLink2Description: Digi-Key Listing; ComponentLink2URL: http://www.digikey.com/product-search/en?keywords=22-27-2041; Price: 0,39; Type: Header, Unshrouded; Contact Finish: Tin; Fastening Type: Friction Lock; Number Of Rows: 1; Series: KK 6410
Safe = Header 2: Header, 2-Pin; LatestRevisionDate: 17-Jul-2002; LatestRevisionNote: Re-released for DXP Platform.; Publisher: Altium Limited
Serial = 22-28-0060: Pin Header, 6 Position, Locking, .1 Centers
U3 = TL082
VR2 = LM7809ACT: Voltage Regulator, Linear, 9V, Pos, 4%, 1A
Y1 = ABM8G-16.000MHZ-18-D2Y-T3: CRYSTAL 16.0000MHZ 18PF SMD; Manufacturer: Abracon LLC; ESR (Equivalent Series Resistance): 80 Ohms; Frequency Stability: ±30ppm; Frequency Tolerance: ±20ppm; Operating Mode: Fundamental; Part Number: ABM8G-16.000MHZ-18-D2Y-T3; ComponentLink1Description: Datasheet; ComponentLink1URL: https://abracon.com/Resonators/ABM8G.pdf; ComponentLink2Description: DigiKey Link; ComponentLink2URL: http://digikey.com/product-detail/en/abracon-llc/ABM8G-16.000MHZ-18-D2Y-T3/535-14314-1-ND/8538154; Device Package: 4-SMD, No Lead; Frequency: 16MHz; Height - Seated (Max): 0.039" (1.00mm); LastUpdated: 15.01.2020 00:15:56; Lifecycle Status: Active; Load Capacitance: 18pF; Minimum Order: 1; Mounting Type: Surface Mount; Operating Temperature: -40°C ~ 85°C; Package / Case: 4-SMD, No Lead; Packaging: TapeAndReel; PartId: 348; Part Status: Active; Price: 0.51; Series: ABM8G; Size / Dimension: 0.126" L x 0.098" W (3.20mm x 2.50mm); Supplier 1: DigiKey; Supplier Part Number 1: 535-14314-1-ND; Type: MHz Crystal; Value: 16MHz